# Altium schematic sheet STM32L475RE.SchDoc
size A2
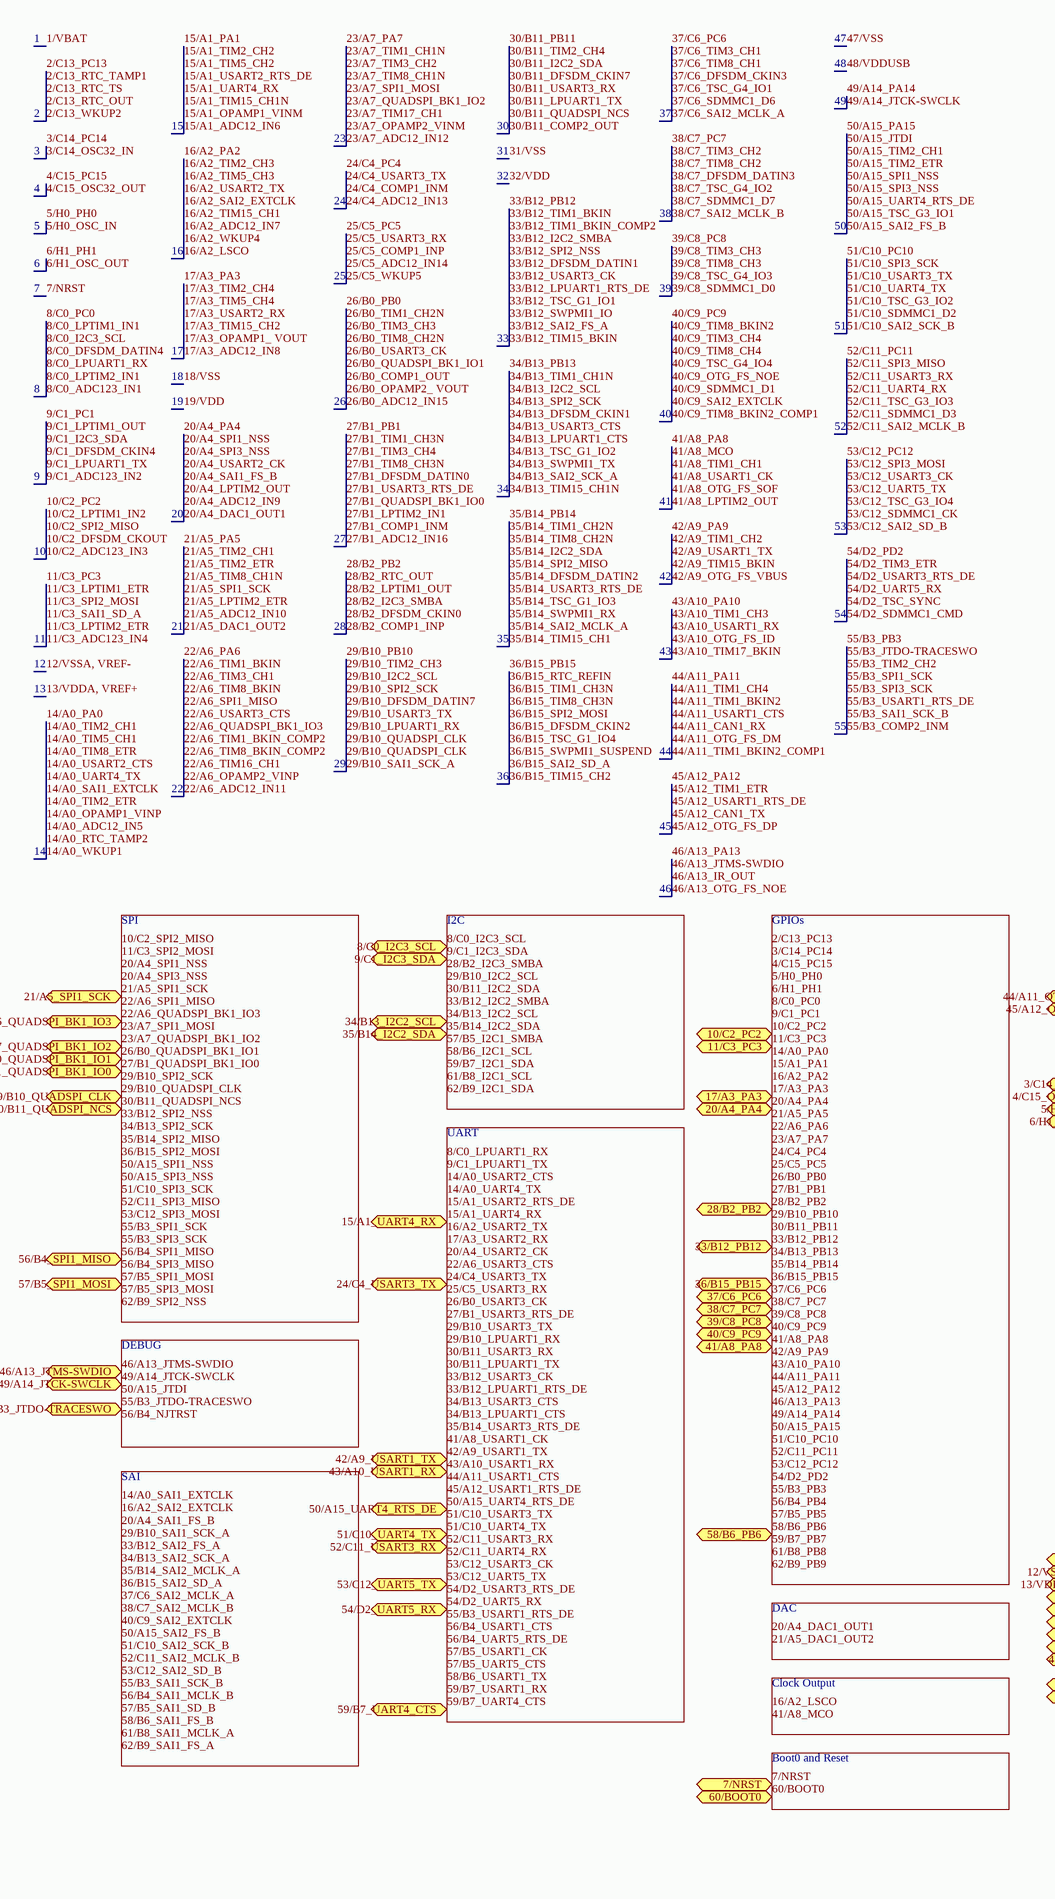
[diagram p0: STM32L475RE.SchDoc, left]
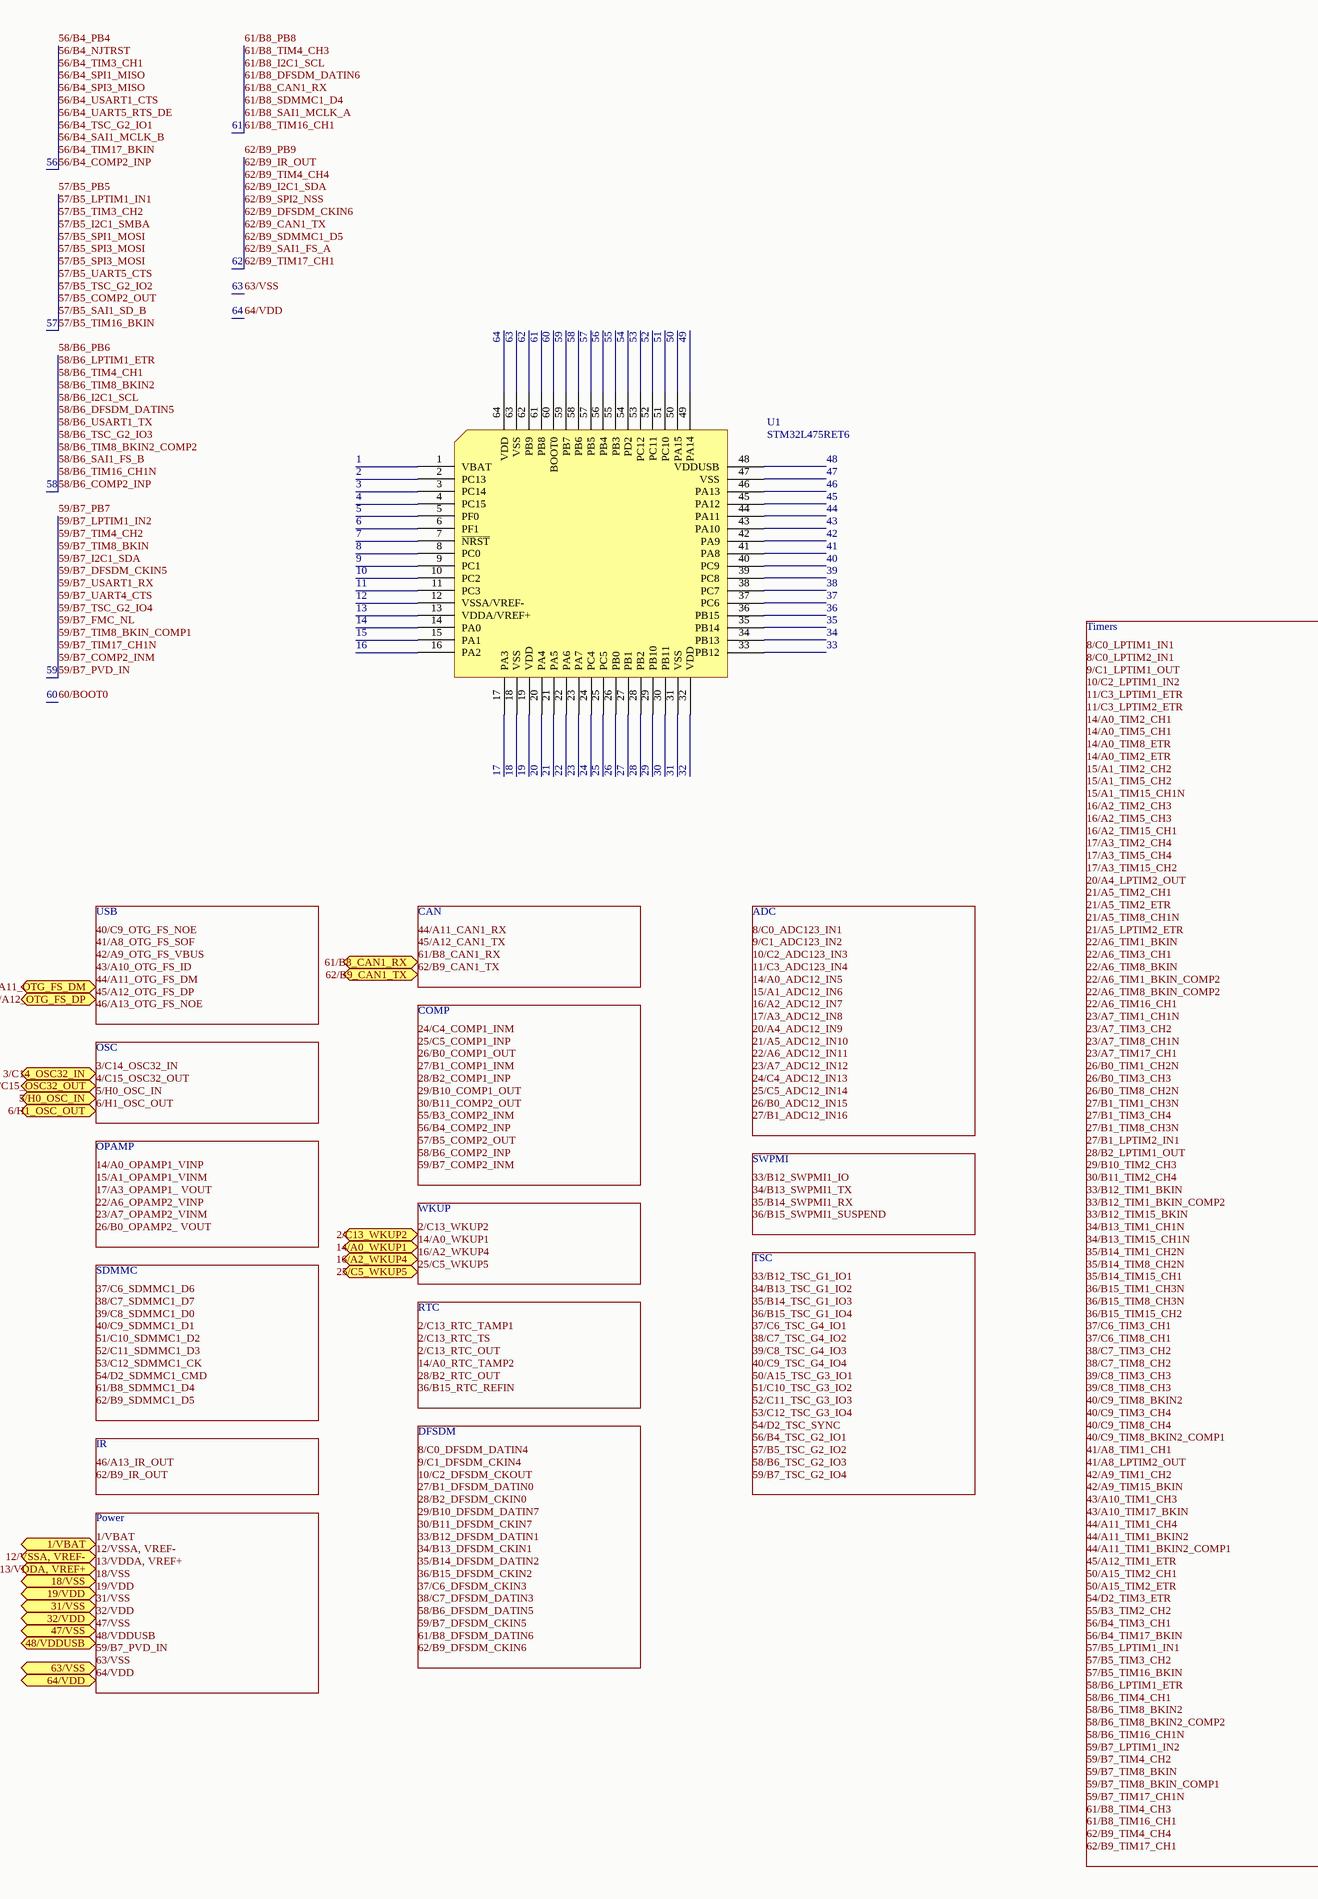
[diagram p1: STM32L475RE.SchDoc, right]

## Parts
U1  STM32L475RET6  [LQFP64 - 10x10 mm]

## Ports
1/VBAT, 2/C13_WKUP2, 3/C14_OSC32_IN, 4/C15_OSC32_OUT, 5/H0_OSC_IN, 6/H1_OSC_OUT, 7/NRST, 8/C0_I2C3_SCL, 9/C1_I2C3_SDA, 10/C2_PC2, 11/C3_PC3, 12/VSSA, VREF-, 13/VDDA, VREF+, 14/A0_WKUP1, 15/A1_UART4_RX, 16/A2_WKUP4, 17/A3_PA3, 18/VSS, 19/VDD, 20/A4_PA4, 21/A5_SPI1_SCK, 22/A6_QUADSPI_BK1_IO3, 23/A7_QUADSPI_BK1_IO2, 24/C4_USART3_TX, 25/C5_WKUP5, 26/B0_QUADSPI_BK1_IO1, 27/B1_QUADSPI_BK1_IO0, 28/B2_PB2, 29/B10_QUADSPI_CLK, 30/B11_QUADSPI_NCS, 31/VSS, 32/VDD, 33/B12_PB12, 34/B13_I2C2_SCL, 35/B14_I2C2_SDA, 36/B15_PB15, 37/C6_PC6, 38/C7_PC7, 39/C8_PC8, 40/C9_PC9, 41/A8_PA8, 42/A9_USART1_TX, 43/A10_USART1_RX, 44/A11_OTG_FS_DM, 45/A12_OTG_FS_DP, 46/A13_JTMS-SWDIO, 47/VSS, 48/VDDUSB, 49/A14_JTCK-SWCLK, 50/A15_UART4_RTS_DE, 51/C10_UART4_TX, 52/C11_USART3_RX, 53/C12_UART5_TX, 54/D2_UART5_RX, 55/B3_JTDO-TRACESWO, 56/B4_SPI1_MISO, 57/B5_SPI1_MOSI, 58/B6_PB6, 59/B7_UART4_CTS, 60/BOOT0, 61/B8_CAN1_RX, 62/B9_CAN1_TX, 63/VSS, 64/VDD

## Nets
1: U1.1(VBAT) ; port 1/VBAT  [also labelled 1/VBAT]
2: U1.2(PC13) ; port 2/C13_WKUP2  [also labelled 2/C13_PC13, 2/C13_RTC_OUT, 2/C13_RTC_TAMP1, 2/C13_RTC_TS, 2/C13_WKUP2]
3: U1.3(PC14) ; port 3/C14_OSC32_IN  [also labelled 3/C14_OSC32_IN, 3/C14_PC14]
4: U1.4(PC15) ; port 4/C15_OSC32_OUT  [also labelled 4/C15_OSC32_OUT, 4/C15_PC15]
5: U1.5(PF0) ; port 5/H0_OSC_IN  [also labelled 5/H0_OSC_IN, 5/H0_PH0]
6: U1.6(PF1) ; port 6/H1_OSC_OUT  [also labelled 6/H1_OSC_OUT, 6/H1_PH1]
7: U1.7(~{NRST}) ; port 7/NRST  [also labelled 7/NRST]
8: U1.8(PC0) ; port 8/C0_I2C3_SCL  [also labelled 8/C0_ADC123_IN1, 8/C0_DFSDM_DATIN4, 8/C0_I2C3_SCL, 8/C0_LPTIM1_IN1, 8/C0_LPTIM2_IN1, 8/C0_LPUART1_RX, 8/C0_PC0]
9: U1.9(PC1) ; port 9/C1_I2C3_SDA  [also labelled 9/C1_ADC123_IN2, 9/C1_DFSDM_CKIN4, 9/C1_I2C3_SDA, 9/C1_LPTIM1_OUT, 9/C1_LPUART1_TX, 9/C1_PC1]
10: U1.10(PC2) ; port 10/C2_PC2  [also labelled 10/C2_ADC123_IN3, 10/C2_DFSDM_CKOUT, 10/C2_LPTIM1_IN2, 10/C2_PC2, 10/C2_SPI2_MISO]
11: U1.11(PC3) ; port 11/C3_PC3  [also labelled 11/C3_ADC123_IN4, 11/C3_LPTIM1_ETR, 11/C3_LPTIM2_ETR, 11/C3_PC3, 11/C3_SAI1_SD_A, 11/C3_SPI2_MOSI]
12: U1.12(VSSA/VREF-) ; port 12/VSSA, VREF-  [also labelled 12/VSSA, VREF-]
13: U1.13(VDDA/VREF+) ; port 13/VDDA, VREF+  [also labelled 13/VDDA, VREF+]
14: U1.14(PA0) ; port 14/A0_WKUP1  [also labelled 14/A0_ADC12_IN5, 14/A0_OPAMP1_VINP, 14/A0_PA0, 14/A0_RTC_TAMP2, 14/A0_SAI1_EXTCLK, 14/A0_TIM2_CH1, 14/A0_TIM2_ETR, 14/A0_TIM5_CH1, 14/A0_TIM8_ETR, 14/A0_UART4_TX, 14/A0_USART2_CTS, 14/A0_WKUP1]
15: U1.15(PA1) ; port 15/A1_UART4_RX  [also labelled 15/A1_ADC12_IN6, 15/A1_OPAMP1_VINM, 15/A1_PA1, 15/A1_TIM15_CH1N, 15/A1_TIM2_CH2, 15/A1_TIM5_CH2, 15/A1_UART4_RX, 15/A1_USART2_RTS_DE]
16: U1.16(PA2) ; port 16/A2_WKUP4  [also labelled 16/A2_ADC12_IN7, 16/A2_LSCO, 16/A2_PA2, 16/A2_SAI2_EXTCLK, 16/A2_TIM15_CH1, 16/A2_TIM2_CH3, 16/A2_TIM5_CH3, 16/A2_USART2_TX, 16/A2_WKUP4]
17: U1.17(PA3) ; port 17/A3_PA3  [also labelled 17/A3_ADC12_IN8, 17/A3_OPAMP1_ VOUT, 17/A3_PA3, 17/A3_TIM15_CH2, 17/A3_TIM2_CH4, 17/A3_TIM5_CH4, 17/A3_USART2_RX]
18: U1.18(VSS) ; port 18/VSS  [also labelled 18/VSS]
19: U1.19(VDD) ; port 19/VDD  [also labelled 19/VDD]
20: U1.20(PA4) ; port 20/A4_PA4  [also labelled 20/A4_ADC12_IN9, 20/A4_DAC1_OUT1, 20/A4_LPTIM2_OUT, 20/A4_PA4, 20/A4_SAI1_FS_B, 20/A4_SPI1_NSS, 20/A4_SPI3_NSS, 20/A4_USART2_CK]
21: U1.21(PA5) ; port 21/A5_SPI1_SCK  [also labelled 21/A5_ADC12_IN10, 21/A5_DAC1_OUT2, 21/A5_LPTIM2_ETR, 21/A5_PA5, 21/A5_SPI1_SCK, 21/A5_TIM2_CH1, 21/A5_TIM2_ETR, 21/A5_TIM8_CH1N]
22: U1.22(PA6) ; port 22/A6_QUADSPI_BK1_IO3  [also labelled 22/A6_ADC12_IN11, 22/A6_OPAMP2_VINP, 22/A6_PA6, 22/A6_QUADSPI_BK1_IO3, 22/A6_SPI1_MISO, 22/A6_TIM16_CH1, 22/A6_TIM1_BKIN, 22/A6_TIM1_BKIN_COMP2, 22/A6_TIM3_CH1, 22/A6_TIM8_BKIN, 22/A6_TIM8_BKIN_COMP2, 22/A6_USART3_CTS]
23: U1.23(PA7) ; port 23/A7_QUADSPI_BK1_IO2  [also labelled 23/A7_ADC12_IN12, 23/A7_OPAMP2_VINM, 23/A7_PA7, 23/A7_QUADSPI_BK1_IO2, 23/A7_SPI1_MOSI, 23/A7_TIM17_CH1, 23/A7_TIM1_CH1N, 23/A7_TIM3_CH2, 23/A7_TIM8_CH1N]
24: U1.24(PC4) ; port 24/C4_USART3_TX  [also labelled 24/C4_ADC12_IN13, 24/C4_COMP1_INM, 24/C4_PC4, 24/C4_USART3_TX]
25: U1.25(PC5) ; port 25/C5_WKUP5  [also labelled 25/C5_ADC12_IN14, 25/C5_COMP1_INP, 25/C5_PC5, 25/C5_USART3_RX, 25/C5_WKUP5]
26: U1.26(PB0) ; port 26/B0_QUADSPI_BK1_IO1  [also labelled 26/B0_ADC12_IN15, 26/B0_COMP1_OUT, 26/B0_OPAMP2_ VOUT, 26/B0_PB0, 26/B0_QUADSPI_BK1_IO1, 26/B0_TIM1_CH2N, 26/B0_TIM3_CH3, 26/B0_TIM8_CH2N, 26/B0_USART3_CK]
27: U1.27(PB1) ; port 27/B1_QUADSPI_BK1_IO0  [also labelled 27/B1_ADC12_IN16, 27/B1_COMP1_INM, 27/B1_DFSDM_DATIN0, 27/B1_LPTIM2_IN1, 27/B1_PB1, 27/B1_QUADSPI_BK1_IO0, 27/B1_TIM1_CH3N, 27/B1_TIM3_CH4, 27/B1_TIM8_CH3N, 27/B1_USART3_RTS_DE]
28: U1.28(PB2) ; port 28/B2_PB2  [also labelled 28/B2_COMP1_INP, 28/B2_DFSDM_CKIN0, 28/B2_I2C3_SMBA, 28/B2_LPTIM1_OUT, 28/B2_PB2, 28/B2_RTC_OUT]
29: U1.29(PB10) ; port 29/B10_QUADSPI_CLK  [also labelled 29/B10_DFSDM_DATIN7, 29/B10_I2C2_SCL, 29/B10_LPUART1_RX, 29/B10_PB10, 29/B10_QUADSPI_CLK, 29/B10_SAI1_SCK_A, 29/B10_SPI2_SCK, 29/B10_TIM2_CH3, 29/B10_USART3_TX]
30: U1.30(PB11) ; port 30/B11_QUADSPI_NCS  [also labelled 30/B11_COMP2_OUT, 30/B11_DFSDM_CKIN7, 30/B11_I2C2_SDA, 30/B11_LPUART1_TX, 30/B11_PB11, 30/B11_QUADSPI_NCS, 30/B11_TIM2_CH4, 30/B11_USART3_RX]
31: U1.31(VSS) ; port 31/VSS  [also labelled 31/VSS]
32: U1.32(VDD) ; port 32/VDD  [also labelled 32/VDD]
33: U1.33(PB12) ; port 33/B12_PB12  [also labelled 33/B12_DFSDM_DATIN1, 33/B12_I2C2_SMBA, 33/B12_LPUART1_RTS_DE, 33/B12_PB12, 33/B12_SAI2_FS_A, 33/B12_SPI2_NSS, 33/B12_SWPMI1_IO, 33/B12_TIM15_BKIN, 33/B12_TIM1_BKIN, 33/B12_TIM1_BKIN_COMP2, 33/B12_TSC_G1_IO1, 33/B12_USART3_CK]
34: U1.34(PB13) ; port 34/B13_I2C2_SCL  [also labelled 34/B13_DFSDM_CKIN1, 34/B13_I2C2_SCL, 34/B13_LPUART1_CTS, 34/B13_PB13, 34/B13_SAI2_SCK_A, 34/B13_SPI2_SCK, 34/B13_SWPMI1_TX, 34/B13_TIM15_CH1N, 34/B13_TIM1_CH1N, 34/B13_TSC_G1_IO2, 34/B13_USART3_CTS]
35: U1.35(PB14) ; port 35/B14_I2C2_SDA  [also labelled 35/B14_DFSDM_DATIN2, 35/B14_I2C2_SDA, 35/B14_PB14, 35/B14_SAI2_MCLK_A, 35/B14_SPI2_MISO, 35/B14_SWPMI1_RX, 35/B14_TIM15_CH1, 35/B14_TIM1_CH2N, 35/B14_TIM8_CH2N, 35/B14_TSC_G1_IO3, 35/B14_USART3_RTS_DE]
36: U1.36(PB15) ; port 36/B15_PB15  [also labelled 36/B15_DFSDM_CKIN2, 36/B15_PB15, 36/B15_RTC_REFIN, 36/B15_SAI2_SD_A, 36/B15_SPI2_MOSI, 36/B15_SWPMI1_SUSPEND, 36/B15_TIM15_CH2, 36/B15_TIM1_CH3N, 36/B15_TIM8_CH3N, 36/B15_TSC_G1_IO4]
37: U1.37(PC6) ; port 37/C6_PC6  [also labelled 37/C6_DFSDM_CKIN3, 37/C6_PC6, 37/C6_SAI2_MCLK_A, 37/C6_SDMMC1_D6, 37/C6_TIM3_CH1, 37/C6_TIM8_CH1, 37/C6_TSC_G4_IO1]
38: U1.38(PC7) ; port 38/C7_PC7  [also labelled 38/C7_DFSDM_DATIN3, 38/C7_PC7, 38/C7_SAI2_MCLK_B, 38/C7_SDMMC1_D7, 38/C7_TIM3_CH2, 38/C7_TIM8_CH2, 38/C7_TSC_G4_IO2]
39: U1.39(PC8) ; port 39/C8_PC8  [also labelled 39/C8_PC8, 39/C8_SDMMC1_D0, 39/C8_TIM3_CH3, 39/C8_TIM8_CH3, 39/C8_TSC_G4_IO3]
40: U1.40(PC9) ; port 40/C9_PC9  [also labelled 40/C9_OTG_FS_NOE, 40/C9_PC9, 40/C9_SAI2_EXTCLK, 40/C9_SDMMC1_D1, 40/C9_TIM3_CH4, 40/C9_TIM8_BKIN2, 40/C9_TIM8_BKIN2_COMP1, 40/C9_TIM8_CH4, 40/C9_TSC_G4_IO4]
41: U1.41(PA8) ; port 41/A8_PA8  [also labelled 41/A8_LPTIM2_OUT, 41/A8_MCO, 41/A8_OTG_FS_SOF, 41/A8_PA8, 41/A8_TIM1_CH1, 41/A8_USART1_CK]
42: U1.42(PA9) ; port 42/A9_USART1_TX  [also labelled 42/A9_OTG_FS_VBUS, 42/A9_PA9, 42/A9_TIM15_BKIN, 42/A9_TIM1_CH2, 42/A9_USART1_TX]
43: U1.43(PA10) ; port 43/A10_USART1_RX  [also labelled 43/A10_OTG_FS_ID, 43/A10_PA10, 43/A10_TIM17_BKIN, 43/A10_TIM1_CH3, 43/A10_USART1_RX]
44: U1.44(PA11) ; port 44/A11_OTG_FS_DM  [also labelled 44/A11_CAN1_RX, 44/A11_OTG_FS_DM, 44/A11_PA11, 44/A11_TIM1_BKIN2, 44/A11_TIM1_BKIN2_COMP1, 44/A11_TIM1_CH4, 44/A11_USART1_CTS]
45: U1.45(PA12) ; port 45/A12_OTG_FS_DP  [also labelled 45/A12_CAN1_TX, 45/A12_OTG_FS_DP, 45/A12_PA12, 45/A12_TIM1_ETR, 45/A12_USART1_RTS_DE]
46: U1.46(PA13) ; port 46/A13_JTMS-SWDIO  [also labelled 46/A13_IR_OUT, 46/A13_JTMS-SWDIO, 46/A13_OTG_FS_NOE, 46/A13_PA13]
47: U1.47(VSS) ; port 47/VSS  [also labelled 47/VSS]
48: U1.48(VDDUSB) ; port 48/VDDUSB  [also labelled 48/VDDUSB]
49: U1.49(PA14) ; port 49/A14_JTCK-SWCLK  [also labelled 49/A14_JTCK-SWCLK, 49/A14_PA14]
50: U1.50(PA15) ; port 50/A15_UART4_RTS_DE  [also labelled 50/A15_JTDI, 50/A15_PA15, 50/A15_SAI2_FS_B, 50/A15_SPI1_NSS, 50/A15_SPI3_NSS, 50/A15_TIM2_CH1, 50/A15_TIM2_ETR, 50/A15_TSC_G3_IO1, 50/A15_UART4_RTS_DE]
51: U1.51(PC10) ; port 51/C10_UART4_TX  [also labelled 51/C10_PC10, 51/C10_SAI2_SCK_B, 51/C10_SDMMC1_D2, 51/C10_SPI3_SCK, 51/C10_TSC_G3_IO2, 51/C10_UART4_TX, 51/C10_USART3_TX]
52: U1.52(PC11) ; port 52/C11_USART3_RX  [also labelled 52/C11_PC11, 52/C11_SAI2_MCLK_B, 52/C11_SDMMC1_D3, 52/C11_SPI3_MISO, 52/C11_TSC_G3_IO3, 52/C11_UART4_RX, 52/C11_USART3_RX]
53: U1.53(PC12) ; port 53/C12_UART5_TX  [also labelled 53/C12_PC12, 53/C12_SAI2_SD_B, 53/C12_SDMMC1_CK, 53/C12_SPI3_MOSI, 53/C12_TSC_G3_IO4, 53/C12_UART5_TX, 53/C12_USART3_CK]
54: U1.54(PD2) ; port 54/D2_UART5_RX  [also labelled 54/D2_PD2, 54/D2_SDMMC1_CMD, 54/D2_TIM3_ETR, 54/D2_TSC_SYNC, 54/D2_UART5_RX, 54/D2_USART3_RTS_DE]
55: U1.55(PB3) ; port 55/B3_JTDO-TRACESWO  [also labelled 55/B3_COMP2_INM, 55/B3_JTDO-TRACESWO, 55/B3_PB3, 55/B3_SAI1_SCK_B, 55/B3_SPI1_SCK, 55/B3_SPI3_SCK, 55/B3_TIM2_CH2, 55/B3_USART1_RTS_DE]
56: U1.56(PB4) ; port 56/B4_SPI1_MISO  [also labelled 56/B4_COMP2_INP, 56/B4_NJTRST, 56/B4_PB4, 56/B4_SAI1_MCLK_B, 56/B4_SPI1_MISO, 56/B4_SPI3_MISO, 56/B4_TIM17_BKIN, 56/B4_TIM3_CH1, 56/B4_TSC_G2_IO1, 56/B4_UART5_RTS_DE, 56/B4_USART1_CTS]
57: U1.57(PB5) ; port 57/B5_SPI1_MOSI  [also labelled 57/B5_COMP2_OUT, 57/B5_I2C1_SMBA, 57/B5_LPTIM1_IN1, 57/B5_PB5, 57/B5_SAI1_SD_B, 57/B5_SPI1_MOSI, 57/B5_SPI3_MOSI, 57/B5_TIM16_BKIN, 57/B5_TIM3_CH2, 57/B5_TSC_G2_IO2, 57/B5_UART5_CTS]
58: U1.58(PB6) ; port 58/B6_PB6  [also labelled 58/B6_COMP2_INP, 58/B6_DFSDM_DATIN5, 58/B6_I2C1_SCL, 58/B6_LPTIM1_ETR, 58/B6_PB6, 58/B6_SAI1_FS_B, 58/B6_TIM16_CH1N, 58/B6_TIM4_CH1, 58/B6_TIM8_BKIN2, 58/B6_TIM8_BKIN2_COMP2, 58/B6_TSC_G2_IO3, 58/B6_USART1_TX]
59: U1.59(PB7) ; port 59/B7_UART4_CTS  [also labelled 59/B7_COMP2_INM, 59/B7_DFSDM_CKIN5, 59/B7_FMC_NL, 59/B7_I2C1_SDA, 59/B7_LPTIM1_IN2, 59/B7_PB7, 59/B7_PVD_IN, 59/B7_TIM17_CH1N, 59/B7_TIM4_CH2, 59/B7_TIM8_BKIN, 59/B7_TIM8_BKIN_COMP1, 59/B7_TSC_G2_IO4, 59/B7_UART4_CTS, 59/B7_USART1_RX]
60: U1.60(BOOT0) ; port 60/BOOT0  [also labelled 60/BOOT0]
61: U1.61(PB8) ; port 61/B8_CAN1_RX  [also labelled 61/B8_CAN1_RX, 61/B8_DFSDM_DATIN6, 61/B8_I2C1_SCL, 61/B8_PB8, 61/B8_SAI1_MCLK_A, 61/B8_SDMMC1_D4, 61/B8_TIM16_CH1, 61/B8_TIM4_CH3]
62: U1.62(PB9) ; port 62/B9_CAN1_TX  [also labelled 62/B9_CAN1_TX, 62/B9_DFSDM_CKIN6, 62/B9_I2C1_SDA, 62/B9_IR_OUT, 62/B9_PB9, 62/B9_SAI1_FS_A, 62/B9_SDMMC1_D5, 62/B9_SPI2_NSS, 62/B9_TIM17_CH1, 62/B9_TIM4_CH4]
63: U1.63(VSS) ; port 63/VSS  [also labelled 63/VSS]
64: U1.64(VDD) ; port 64/VDD  [also labelled 64/VDD]

## Notes on the sheet
- Timers
- SPI
- I2C
- GPIOs
- USB
- CAN
- ADC
- COMP
- OSC
- UART
- OPAMP
- WKUP
- SWPMI
- TSC
- DEBUG
- SDMMC
- RTC
- IR
- DFSDM
- SAI
- Power
- DAC
- Clock Output
- Boot0 and Reset
- Labels drawn without touching a wire or pin: 2/C13_PC13, 2/C13_RTC_OUT, 2/C13_RTC_TAMP1, 2/C13_RTC_TS, 3/C14_PC14, 4/C15_PC15, 5/H0_PH0, 6/H1_PH1, 8/C0_ADC123_IN1, 8/C0_DFSDM_DATIN4, 8/C0_LPTIM1_IN1, 8/C0_LPTIM2_IN1, 8/C0_LPUART1_RX, 8/C0_PC0, 9/C1_ADC123_IN2, 9/C1_DFSDM_CKIN4, 9/C1_LPTIM1_OUT, 9/C1_LPUART1_TX, 9/C1_PC1, 10/C2_ADC123_IN3, 10/C2_DFSDM_CKOUT, 10/C2_LPTIM1_IN2, 10/C2_SPI2_MISO, 11/C3_ADC123_IN4, 11/C3_LPTIM1_ETR, 11/C3_LPTIM2_ETR, 11/C3_SPI2_MOSI, 14/A0_ADC12_IN5, 14/A0_OPAMP1_VINP, 14/A0_PA0, 14/A0_RTC_TAMP2, 14/A0_SAI1_EXTCLK, 14/A0_TIM2_CH1, 14/A0_TIM2_ETR, 14/A0_TIM5_CH1, 14/A0_TIM8_ETR, 14/A0_UART4_TX, 14/A0_USART2_CTS, 15/A1_ADC12_IN6, 15/A1_OPAMP1_VINM, 15/A1_PA1, 15/A1_TIM2_CH2, 15/A1_TIM5_CH2, 15/A1_TIM15_CH1N, 15/A1_USART2_RTS_DE, 16/A2_ADC12_IN7, 16/A2_LSCO, 16/A2_PA2, 16/A2_SAI2_EXTCLK, 16/A2_TIM2_CH3, 16/A2_TIM5_CH3, 16/A2_TIM15_CH1, 16/A2_USART2_TX, 17/A3_ADC12_IN8, 17/A3_OPAMP1_ VOUT, 17/A3_TIM2_CH4, 17/A3_TIM5_CH4, 17/A3_TIM15_CH2, 17/A3_USART2_RX, 20/A4_ADC12_IN9, 20/A4_DAC1_OUT1, 20/A4_LPTIM2_OUT, 20/A4_SAI1_FS_B, 20/A4_SPI1_NSS, 20/A4_SPI3_NSS, 20/A4_USART2_CK, 21/A5_ADC12_IN10, 21/A5_DAC1_OUT2, 21/A5_LPTIM2_ETR, 21/A5_PA5, 21/A5_TIM2_CH1, 21/A5_TIM2_ETR, 21/A5_TIM8_CH1N, 22/A6_ADC12_IN11, 22/A6_OPAMP2_VINP, 22/A6_PA6, 22/A6_SPI1_MISO, 22/A6_TIM1_BKIN, 22/A6_TIM1_BKIN_COMP2, 22/A6_TIM3_CH1, 22/A6_TIM8_BKIN, 22/A6_TIM8_BKIN_COMP2, 22/A6_TIM16_CH1, 22/A6_USART3_CTS, 23/A7_ADC12_IN12, 23/A7_OPAMP2_VINM, 23/A7_PA7, 23/A7_SPI1_MOSI, 23/A7_TIM1_CH1N, 23/A7_TIM3_CH2, 23/A7_TIM8_CH1N, 23/A7_TIM17_CH1, 24/C4_ADC12_IN13, 24/C4_COMP1_INM, 24/C4_PC4, 25/C5_ADC12_IN14, 25/C5_COMP1_INP, 25/C5_PC5, 25/C5_USART3_RX, 26/B0_ADC12_IN15, 26/B0_COMP1_OUT, 26/B0_OPAMP2_ VOUT, 26/B0_PB0, 26/B0_TIM1_CH2N, 26/B0_TIM3_CH3, 26/B0_TIM8_CH2N, 26/B0_USART3_CK, 27/B1_ADC12_IN16, 27/B1_COMP1_INM, 27/B1_DFSDM_DATIN0, 27/B1_LPTIM2_IN1, 27/B1_PB1, 27/B1_TIM1_CH3N, 27/B1_TIM3_CH4, 27/B1_TIM8_CH3N, 27/B1_USART3_RTS_DE, 28/B2_COMP1_INP, 28/B2_DFSDM_CKIN0, 28/B2_I2C3_SMBA, 28/B2_LPTIM1_OUT, 28/B2_RTC_OUT, 29/B10_COMP1_OUT, 29/B10_DFSDM_DATIN7, 29/B10_I2C2_SCL, 29/B10_LPUART1_RX, 29/B10_PB10, 29/B10_SAI1_SCK_A, 29/B10_SPI2_SCK, 29/B10_TIM2_CH3, 29/B10_USART3_TX, 30/B11_COMP2_OUT, 30/B11_DFSDM_CKIN7, 30/B11_I2C2_SDA, 30/B11_LPUART1_TX, 30/B11_PB11, 30/B11_TIM2_CH4, 30/B11_USART3_RX, 33/B12_DFSDM_DATIN1, 33/B12_I2C2_SMBA, 33/B12_LPUART1_RTS_DE, 33/B12_SAI2_FS_A, 33/B12_SPI2_NSS, 33/B12_SWPMI1_IO, 33/B12_TIM1_BKIN, 33/B12_TIM1_BKIN_COMP2, 33/B12_TIM15_BKIN, 33/B12_TSC_G1_IO1, 33/B12_USART3_CK, 34/B13_DFSDM_CKIN1, 34/B13_LPUART1_CTS, 34/B13_PB13, 34/B13_SAI2_SCK_A, 34/B13_SPI2_SCK, 34/B13_SWPMI1_TX, 34/B13_TIM1_CH1N, 34/B13_TIM15_CH1N, 34/B13_TSC_G1_IO2, 34/B13_USART3_CTS, 35/B14_DFSDM_DATIN2, 35/B14_PB14, 35/B14_SAI2_MCLK_A, 35/B14_SPI2_MISO, 35/B14_SWPMI1_RX, 35/B14_TIM1_CH2N, 35/B14_TIM8_CH2N, 35/B14_TIM15_CH1, 35/B14_TSC_G1_IO3, 35/B14_USART3_RTS_DE, 36/B15_DFSDM_CKIN2, 36/B15_RTC_REFIN, 36/B15_SAI2_SD_A, 36/B15_SPI2_MOSI, 36/B15_SWPMI1_SUSPEND, 36/B15_TIM1_CH3N, 36/B15_TIM8_CH3N, 36/B15_TIM15_CH2, 36/B15_TSC_G1_IO4, 37/C6_DFSDM_CKIN3, 37/C6_SAI2_MCLK_A, 37/C6_SDMMC1_D6, 37/C6_TIM3_CH1, 37/C6_TIM8_CH1, 37/C6_TSC_G4_IO1, 38/C7_DFSDM_DATIN3, 38/C7_SAI2_MCLK_B, 38/C7_SDMMC1_D7, 38/C7_TIM3_CH2, 38/C7_TIM8_CH2, 38/C7_TSC_G4_IO2, 39/C8_SDMMC1_D0, 39/C8_TIM3_CH3, 39/C8_TIM8_CH3, 39/C8_TSC_G4_IO3, 40/C9_OTG_FS_NOE, 40/C9_SAI2_EXTCLK, 40/C9_SDMMC1_D1, 40/C9_TIM3_CH4, 40/C9_TIM8_BKIN2, 40/C9_TIM8_BKIN2_COMP1, 40/C9_TIM8_CH4, 40/C9_TSC_G4_IO4, 41/A8_LPTIM2_OUT, 41/A8_MCO, 41/A8_OTG_FS_SOF, 41/A8_TIM1_CH1, 41/A8_USART1_CK, 42/A9_OTG_FS_VBUS, 42/A9_PA9, 42/A9_TIM1_CH2, 42/A9_TIM15_BKIN, 43/A10_OTG_FS_ID, 43/A10_PA10, 43/A10_TIM1_CH3, 43/A10_TIM17_BKIN, 44/A11_CAN1_RX, 44/A11_PA11, 44/A11_TIM1_BKIN2, 44/A11_TIM1_BKIN2_COMP1, 44/A11_TIM1_CH4, 44/A11_USART1_CTS, 45/A12_CAN1_TX, 45/A12_PA12, 45/A12_TIM1_ETR, 45/A12_USART1_RTS_DE, 46/A13_IR_OUT, 46/A13_OTG_FS_NOE, 46/A13_PA13, 49/A14_PA14, 50/A15_JTDI, 50/A15_PA15, 50/A15_SAI2_FS_B, 50/A15_SPI1_NSS, 50/A15_SPI3_NSS, 50/A15_TIM2_CH1, 50/A15_TIM2_ETR, 50/A15_TSC_G3_IO1, 51/C10_PC10, 51/C10_SAI2_SCK_B, 51/C10_SDMMC1_D2, 51/C10_SPI3_SCK, 51/C10_TSC_G3_IO2, 51/C10_USART3_TX, 52/C11_PC11, 52/C11_SAI2_MCLK_B, 52/C11_SDMMC1_D3, 52/C11_SPI3_MISO, 52/C11_TSC_G3_IO3, 52/C11_UART4_RX, 53/C12_PC12, 53/C12_SAI2_SD_B, 53/C12_SDMMC1_CK, 53/C12_SPI3_MOSI, 53/C12_TSC_G3_IO4, 53/C12_USART3_CK, 54/D2_PD2, 54/D2_SDMMC1_CMD, 54/D2_TIM3_ETR, 54/D2_TSC_SYNC, 54/D2_USART3_RTS_DE, 55/B3_COMP2_INM, 55/B3_PB3, 55/B3_SAI1_SCK_B, 55/B3_SPI1_SCK, 55/B3_SPI3_SCK, 55/B3_TIM2_CH2, 55/B3_USART1_RTS_DE, 56/B4_COMP2_INP, 56/B4_NJTRST, 56/B4_PB4, 56/B4_SAI1_MCLK_B, 56/B4_SPI3_MISO, 56/B4_TIM3_CH1, 56/B4_TIM17_BKIN, 56/B4_TSC_G2_IO1, 56/B4_UART5_RTS_DE, 56/B4_USART1_CTS, 57/B5_COMP2_OUT, 57/B5_I2C1_SMBA, 57/B5_LPTIM1_IN1, 57/B5_PB5, 57/B5_SAI1_SD_B, 57/B5_SPI3_MOSI, 57/B5_TIM3_CH2, 57/B5_TIM16_BKIN, 57/B5_TSC_G2_IO2, 57/B5_UART5_CTS, 57/B5_USART1_CK, 58/B6_COMP2_INP, 58/B6_DFSDM_DATIN5, 58/B6_I2C1_SCL, 58/B6_LPTIM1_ETR, 58/B6_SAI1_FS_B, 58/B6_TIM4_CH1, 58/B6_TIM8_BKIN2, 58/B6_TIM8_BKIN2_COMP2, 58/B6_TIM16_CH1N, 58/B6_TSC_G2_IO3, 58/B6_USART1_TX, 59/B7_COMP2_INM, 59/B7_DFSDM_CKIN5, 59/B7_I2C1_SDA, 59/B7_LPTIM1_IN2, 59/B7_PB7, 59/B7_PVD_IN, 59/B7_TIM4_CH2, 59/B7_TIM8_BKIN, 59/B7_TIM8_BKIN_COMP1, 59/B7_TIM17_CH1N, 59/B7_TSC_G2_IO4, 59/B7_USART1_RX, 61/B8_DFSDM_DATIN6, 61/B8_I2C1_SCL, 61/B8_PB8, 61/B8_SAI1_MCLK_A, 61/B8_SDMMC1_D4, 61/B8_TIM4_CH3, 61/B8_TIM16_CH1, 62/B9_DFSDM_CKIN6, 62/B9_I2C1_SDA, 62/B9_IR_OUT, 62/B9_PB9, 62/B9_SAI1_FS_A, 62/B9_SDMMC1_D5, 62/B9_SPI2_NSS, 62/B9_TIM4_CH4, 62/B9_TIM17_CH1

## Library data of the parts
U1 = STM32L475RET6: Cortex M4; Revised: 120406; target: BASE; Code: ISR02010257; Bus width: 32; Voltage: 1V71-3V6; Voltage max: 4; FLASH: 512k; SRAM: 128k+32k; Part Number: STM32L475RET6; Part Type: MCU; Value: STM32L475RET6; Library path: SIMBOLS_CPU_MCU.SCHLIB; Footprint path: FootprintsPersonals.PcbLib